# EasyEDA Pro project PCBPhaseidk.eprj

# Schematic PCBPhase
Create Date: 2024-09-20; Page Name: P1; Project Name: PCBPhase; Schematic Name: PCBPhase; Update Date: 2024-09-19; Company: EasyEDA.com; Drawn: EasyEDA; Page Size: A4; Part Number: JLCPCB-002; Reviewed: EasyEDA; Version: V0.1
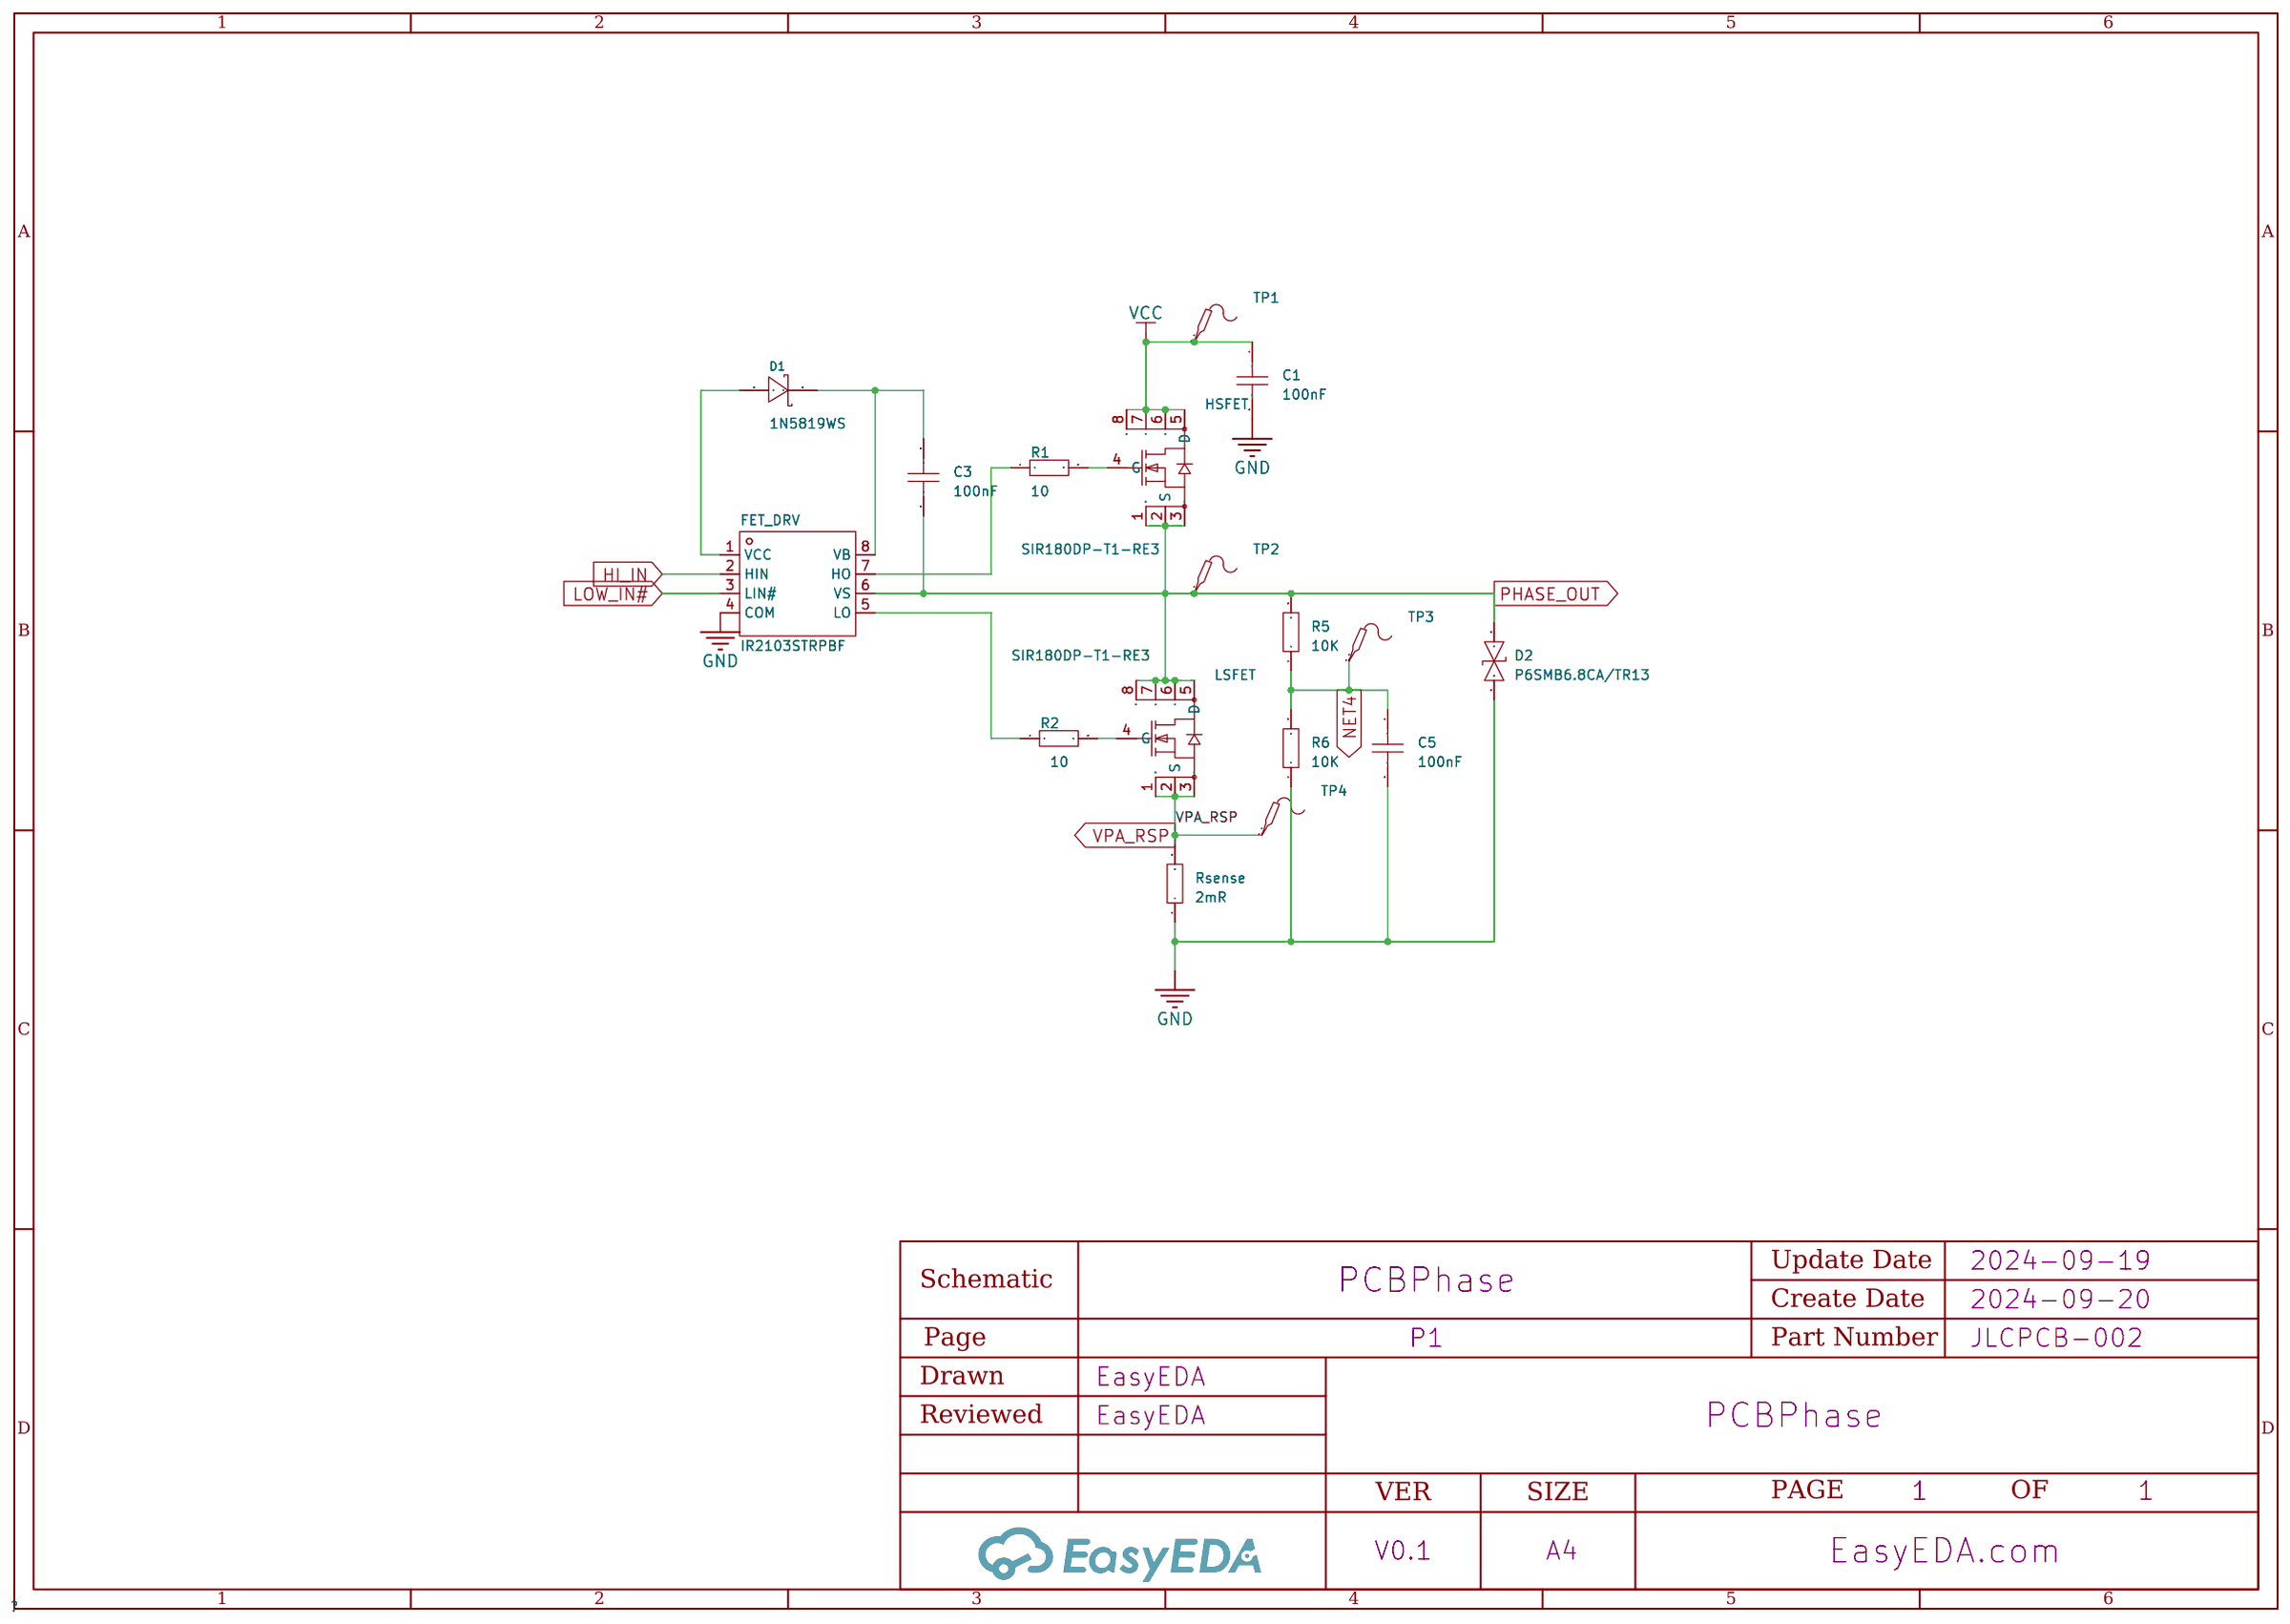
[diagram p0: schematic sheet]

## Parts
C1  100nF  [C0603]
C3  100nF  [C0603]
C5  100nF  [C0603]
D1  1N5819WS  [SOD-323_L1.8-W1.3-LS2.5-RD]
D2  P6SMB6.8CA/TR13  [SMB_L4.6-W3.6-LS5.3-BI]
FET_DRV  IR2103STRPBF  [SOIC-8_L4.9-W3.9-P1.27-LS6.0-BL]
HSFET  SIR180DP-T1-RE3  [POWERPAK-SO-8_L5.9-W4.9-P1.27-LS6.2-BL]
LSFET  SIR180DP-T1-RE3  [POWERPAK-SO-8_L5.9-W4.9-P1.27-LS6.2-BL]
R1  10  [R0603]
R2  10  [R0603]
R5  10K  [R0603]
R6  10K  [R0603]
Rsense  2mR  [R0603]
TP1  -  [Test-Point-0.5mm]
TP2  -  [Test-Point-0.5mm]
TP3  -  [Test-Point-0.5mm]
TP4  -  [Test-Point-0.5mm]

## Library data of the parts
C1 C3 C5 = CAP_0603: Supplier Footprint: 0603
D1 = 1N5819WS_C191023: Forward Voltage (Vf@If):600mV@1A Reverse Voltage (Vr):40V Average Rectified Current (Io):1A; LCSC Part Name: 电压:40V 电流:1A; Supplier Part: C191023; Manufacturer: Hottech(合科泰); Supplier Footprint: SOD-323; JLCPCB Part Class: Basic Part; Datasheet: https://atta.szlcsc.com/upload/public/pdf/source/20220428/3CB86FD8D28D653594B4E35F9D5AEFD9.pdf; Supplier: LCSC; Forward Voltage (Vf@If): 600mV@1A; Reverse Voltage (Vr): 40V; Average Rectified Current (Io): 1A
D2 = P6SMB6.8CA/TR13: Reverse Stand-Off Voltage (Vrwm):5.8V Maximum Clamping Voltage:10.5V Peak Pulse Current (Ipp)@10/1000us:58.1A Peak Pulse Power Dissipation (Ppp)@10/1000us:600W Breakdown Voltage:6.45V Type:TVS; Supplier Part: C78395; Manufacturer: Brightking(君耀电子); Supplier Footprint: SMB(DO-214AA); JLCPCB Part Class: Basic Part; Datasheet: https://atta.szlcsc.com/upload/public/pdf/source/20160709/1468031879762.pdf; Supplier: LCSC; Reverse Stand-Off Voltage (Vrwm): 5.8V; Maximum Clamping Voltage: 10.5V; Peak Pulse Current (Ipp)@10/1000us: 58.1A; Peak Pulse Power Dissipation (Ppp)@10/1000us: 600W; Breakdown Voltage: 6.45V; Type: TVS
FET_DRV = IR2103STRPBF: Driven Configuration:Half Bridge Load Type:MOSFET；IGBT Number of Drivers:2 Peak Output Current(sink):360mA Peak Output Current(source):210mA Supply Voltage:10V~20V Supply Voltage:10V~20V Rise Time:100ns Fall Time:50ns Operating Temperature:-40℃~+150℃@(Tj); Supplier Part: C2957; Manufacturer: Infineon(英飞凌); Supplier Footprint: SOIC-8; JLCPCB Part Class: Extended Part; Datasheet: https://atta.szlcsc.com/upload/public/pdf/source/20140228/1457706997637.pdf; Supplier: LCSC; Driven Configuration: Half Bridge; Load Type: MOSFET；IGBT; Number of Drivers: 2; Peak Output Current(sink): 360mA; Peak Output Current(source): 210mA; Supply Voltage: 10V~20V; Rise Time: 100ns; Fall Time: 50ns; Operating Temperature: -40℃~+150℃@(Tj)
HSFET LSFET = SIR180DP-T1-RE3: Type:1个NChannel Drain Source Voltage (Vdss):60V Continuous Drain Current (Id):；32.4A Power Dissipation (Pd):； Drain Source On Resistance (RDS(on)@Vgs,Id):2.05mΩ@10A,10V Gate Threshold Voltage (Vgs(th)@Id):3.6V@250uA Total Gate Charge (Qg@Vgs):87nC@10V Inp; LCSC Part Name: 1个N沟道 耐压:60V 电流:60A 电流:32.4A; Supplier Part: C5334421; Manufacturer: VISHAY(威世); Supplier Footprint: SO-8; JLCPCB Part Class: Extended Part; Datasheet: https://atta.szlcsc.com/upload/public/pdf/source/20221230/5EAF42ED79532020A551540FC13481A3.pdf; Supplier: LCSC; Type: 1个NChannel; Drain Source Voltage (Vdss): 60V; Continuous Drain Current (Id): ；32.4A; Power Dissipation (Pd): ；; Drain Source On Resistance (RDS(on)@Vgs,Id): 2.05mΩ@10A,10V; Gate Threshold Voltage (Vgs(th)@Id): 3.6V@250uA; Total Gate Charge (Qg@Vgs): 87nC@10V; Input Capacitance (Ciss@Vds): 4.03nF@30V; Operating Temperature: -55℃~+150℃@(Tj)
R1 R2 R5 R6 Rsense = Res_0603: Supplier Footprint: 0603
TP1-TP4 = Test-Point: Test Point 测试点

## Nets
GND: C1.2 C5.2 D2.1 FET_DRV.4(COM) R6.1 Rsense.1
VCC: C1.1 HSFET.5(D) HSFET.6(D) HSFET.7(D) HSFET.8(D) TP1.1
HI_IN: FET_DRV.2(HIN)
LOW_IN#: FET_DRV.3(LIN#)
NET4: C5.1 R5.1 R6.2 TP3.1
PHASE_OUT: C3.2 D2.2 FET_DRV.6(VS) HSFET.1(S) HSFET.2(S) HSFET.3(S) LSFET.5(D) LSFET.6(D) LSFET.7(D) LSFET.8(D) R5.2 TP2.1
VPA_RSP: LSFET.1(S) LSFET.2(S) LSFET.3(S) Rsense.2 TP4.1
$1N508: FET_DRV.7(HO) R1.1
$1N509: HSFET.4(G) R1.2
$1N510: FET_DRV.5(LO) R2.1
$1N511: LSFET.4(G) R2.2
$1N519: D1.2(A) FET_DRV.1(VCC)
$1N521: C3.1 D1.1(K) FET_DRV.8(VB)

# Schematic Schematic1
Create Date: 2024-09-20; Page Name: P1; Project Name: PCBPhase; Schematic Name: Schematic1; Update Date: 2024-09-20; Company: EasyEDA.com; Drawn: EasyEDA; Page Size: A4; Part Number: JLCPCB-002; Reviewed: EasyEDA; Version: V0.1
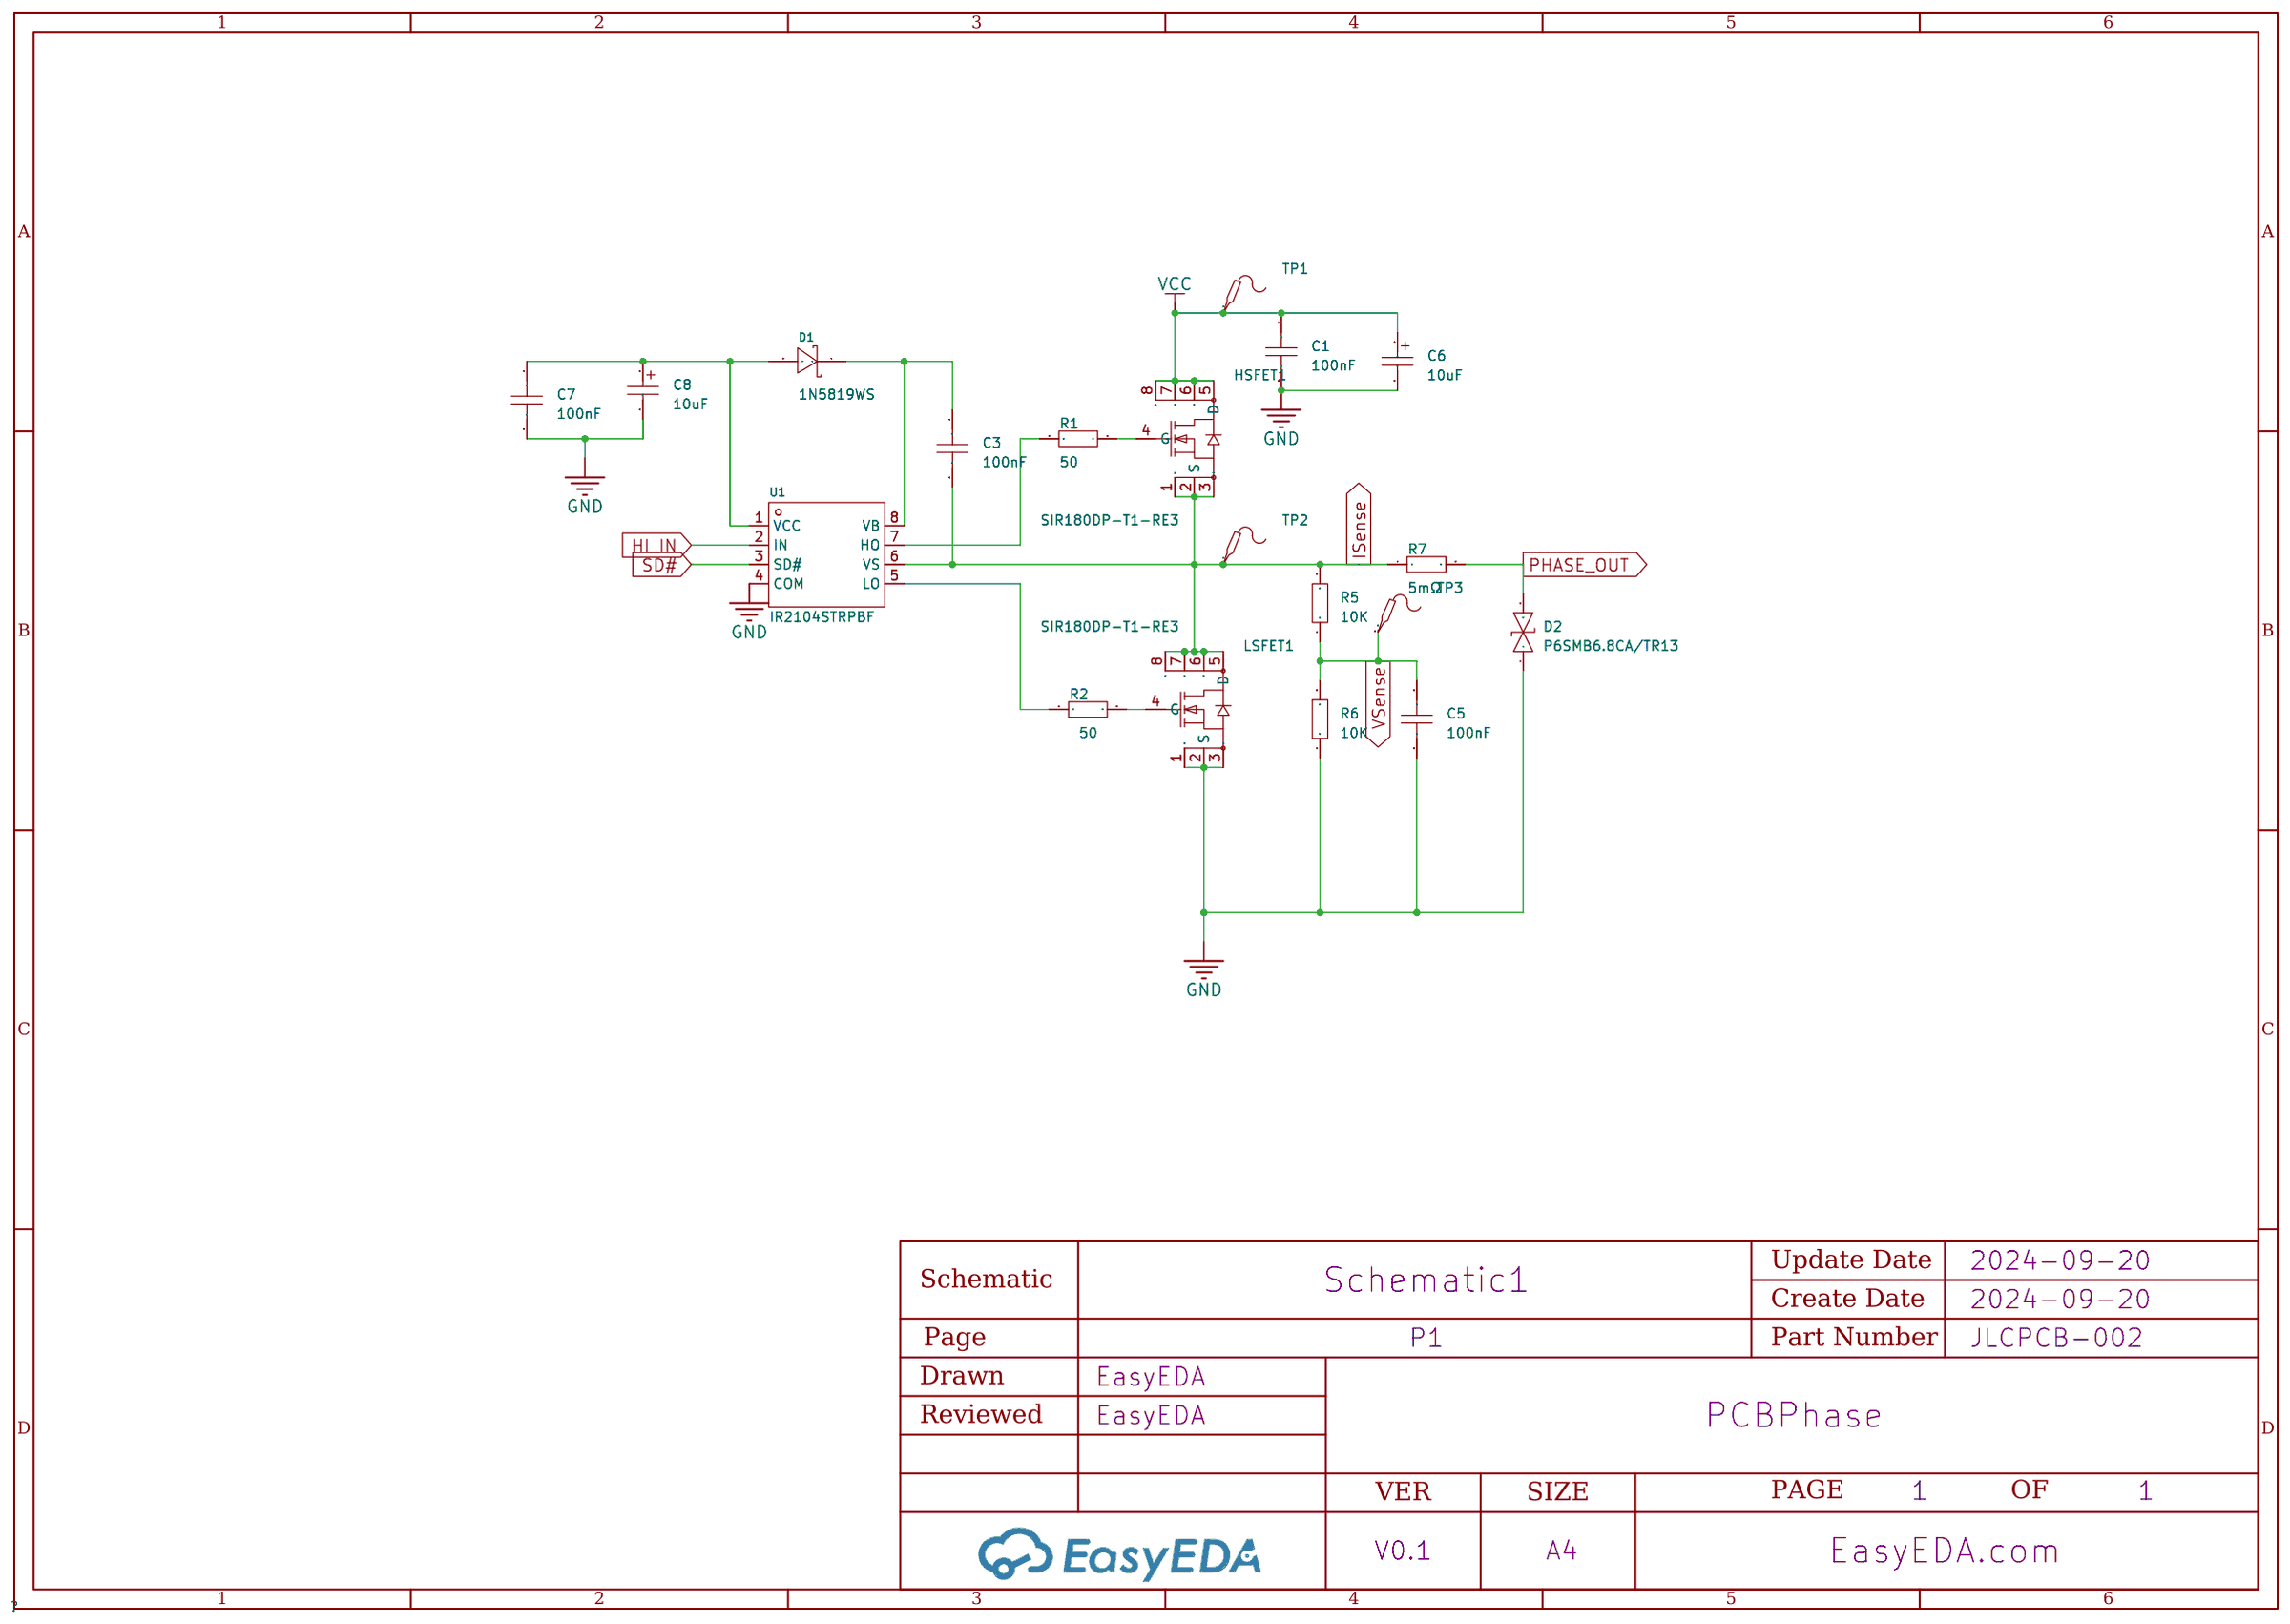
[diagram p1: schematic sheet]

## Parts
C1  100nF  [C0603]
C3  100nF  [C0603]
C5  100nF  [C0603]
C6  10uF  [CAP-SMD_BD3.0-L3.3-W3.3-RD]
C7  100nF  [C0603]
C8  10uF  [CAP-SMD_BD3.0-L3.3-W3.3-RD]
D1  1N5819WS  [SOD-323_L1.8-W1.3-LS2.5-RD]
D2  P6SMB6.8CA/TR13  [SMB_L4.6-W3.6-LS5.3-BI]
HSFET1  SIR180DP-T1-RE3  [POWERPAK-SO-8_L5.9-W4.9-P1.27-LS6.2-BL]
LSFET1  SIR180DP-T1-RE3  [POWERPAK-SO-8_L5.9-W4.9-P1.27-LS6.2-BL]
R1  50  [R0603]
R2  50  [R0603]
R5  10K  [R0603]
R6  10K  [R0603]
R7  5mΩ  [R2512]
TP1  -  [Test-Point-0.5mm]
TP2  -  [Test-Point-0.5mm]
TP3  -  [Test-Point-0.5mm]
U1  IR2104STRPBF  [SOIC-8_L4.9-W3.9-P1.27-LS6.0-BL]

## Library data of the parts
C1 C3 C5 C7 = CAP_0603: Supplier Footprint: 0603
C6 C8 = C_Ele_SMD_3x5.4mm: Supplier Footprint: SMD,3x5.4mm
D1 = 1N5819WS_C191023: Forward Voltage (Vf@If):600mV@1A Reverse Voltage (Vr):40V Average Rectified Current (Io):1A; LCSC Part Name: 电压:40V 电流:1A; Supplier Part: C191023; Manufacturer: Hottech(合科泰); Supplier Footprint: SOD-323; JLCPCB Part Class: Basic Part; Datasheet: https://atta.szlcsc.com/upload/public/pdf/source/20220428/3CB86FD8D28D653594B4E35F9D5AEFD9.pdf; Supplier: LCSC; Forward Voltage (Vf@If): 600mV@1A; Reverse Voltage (Vr): 40V; Average Rectified Current (Io): 1A
D2 = P6SMB6.8CA/TR13: Reverse Stand-Off Voltage (Vrwm):5.8V Maximum Clamping Voltage:10.5V Peak Pulse Current (Ipp)@10/1000us:58.1A Peak Pulse Power Dissipation (Ppp)@10/1000us:600W Breakdown Voltage:6.45V Type:TVS; Supplier Part: C78395; Manufacturer: Brightking(君耀电子); Supplier Footprint: SMB(DO-214AA); JLCPCB Part Class: Basic Part; Datasheet: https://atta.szlcsc.com/upload/public/pdf/source/20160709/1468031879762.pdf; Supplier: LCSC; Reverse Stand-Off Voltage (Vrwm): 5.8V; Maximum Clamping Voltage: 10.5V; Peak Pulse Current (Ipp)@10/1000us: 58.1A; Peak Pulse Power Dissipation (Ppp)@10/1000us: 600W; Breakdown Voltage: 6.45V; Type: TVS
HSFET1 LSFET1 = SIR180DP-T1-RE3: Type:1个NChannel Drain Source Voltage (Vdss):60V Continuous Drain Current (Id):；32.4A Power Dissipation (Pd):； Drain Source On Resistance (RDS(on)@Vgs,Id):2.05mΩ@10A,10V Gate Threshold Voltage (Vgs(th)@Id):3.6V@250uA Total Gate Charge (Qg@Vgs):87nC@10V Inp; LCSC Part Name: 1个N沟道 耐压:60V 电流:60A 电流:32.4A; Supplier Part: C5334421; Manufacturer: VISHAY(威世); Supplier Footprint: SO-8; JLCPCB Part Class: Extended Part; Datasheet: https://atta.szlcsc.com/upload/public/pdf/source/20221230/5EAF42ED79532020A551540FC13481A3.pdf; Supplier: LCSC; Type: 1个NChannel; Drain Source Voltage (Vdss): 60V; Continuous Drain Current (Id): ；32.4A; Power Dissipation (Pd): ；; Drain Source On Resistance (RDS(on)@Vgs,Id): 2.05mΩ@10A,10V; Gate Threshold Voltage (Vgs(th)@Id): 3.6V@250uA; Total Gate Charge (Qg@Vgs): 87nC@10V; Input Capacitance (Ciss@Vds): 4.03nF@30V; Operating Temperature: -55℃~+150℃@(Tj)
R1 R2 R5 R6 = Res_0603: Supplier Footprint: 0603
R7 = PA2512FKF7W0R005E: Type:Current Sensing Resistors Resistance: Tolerance:±1% Tolerance:±1% Power(Watts): Temperature Coefficient:±100ppm/℃ Temperature Coefficient:±100ppm/℃; LCSC Part Name: 5mΩ ±1% 2W; Supplier Part: C309526; Manufacturer: YAGEO(国巨); Supplier Footprint: 2512; JLCPCB Part Class: Extended Part; Datasheet: https://atta.szlcsc.com/upload/public/pdf/source/20190227/C375693_219964CC8B3EBD36DBDF701587FA5938.pdf; Supplier: LCSC; Type: Current Sensing Resistors; Tolerance: ±1%; Temperature Coefficient: ±100ppm/℃
TP1-TP3 = Test-Point: Test Point 测试点
U1 = IR2104STRPBF: Driven Configuration:Half Bridge Load Type:MOSFET；IGBT Number of Drivers:2 Peak Output Current(sink):360mA Peak Output Current(source):210mA Supply Voltage:10V~20V Supply Voltage:10V~20V Rise Time:100ns Fall Time:50ns Operating Temperature:-40℃~+150℃@(Tj); Supplier Part: C2960; Manufacturer: Infineon(英飞凌); Supplier Footprint: SOIC-8; JLCPCB Part Class: Extended Part; Datasheet: https://atta.szlcsc.com/upload/public/pdf/source/20140906/1457707236579.pdf; Supplier: LCSC; Driven Configuration: Half Bridge; Load Type: MOSFET；IGBT; Number of Drivers: 2; Peak Output Current(sink): 360mA; Peak Output Current(source): 210mA; Supply Voltage: 10V~20V; Rise Time: 100ns; Fall Time: 50ns; Operating Temperature: -40℃~+150℃@(Tj)

## Nets
GND: C1.2 C5.2 C6.2 C7.2 C8.2 D2.1 LSFET1.1(S) LSFET1.2(S) LSFET1.3(S) R6.1 U1.4(COM)
VCC: C1.1 C6.1 HSFET1.5(D) HSFET1.6(D) HSFET1.7(D) HSFET1.8(D) TP1.1
HI_IN: U1.2(IN)
ISense: C3.2 HSFET1.1(S) HSFET1.2(S) HSFET1.3(S) LSFET1.5(D) LSFET1.6(D) LSFET1.7(D) LSFET1.8(D) R5.2 R7.1 TP2.1 U1.6(VS)
PHASE_OUT: D2.2 R7.2
SD#: U1.3(SD#)
VSense: C5.1 R5.1 R6.2 TP3.1
$1N697: R1.1 U1.7(HO)
$1N698: HSFET1.4(G) R1.2
$1N699: R2.1 U1.5(LO)
$1N700: LSFET1.4(G) R2.2
$1N719: C3.1 D1.1(K) U1.8(VB)
$1N721: C7.1 C8.1 D1.2(A) U1.1(VCC)

# Schematic Schematic2
Create Date: 2024-09-20; Page Name: P1; Project Name: PCBPhase; Schematic Name: Schematic2; Update Date: 2024-09-20; Company: EasyEDA.com; Drawn: EasyEDA; Page Size: A4; Part Number: JLCPCB-002; Reviewed: EasyEDA; Version: V0.1
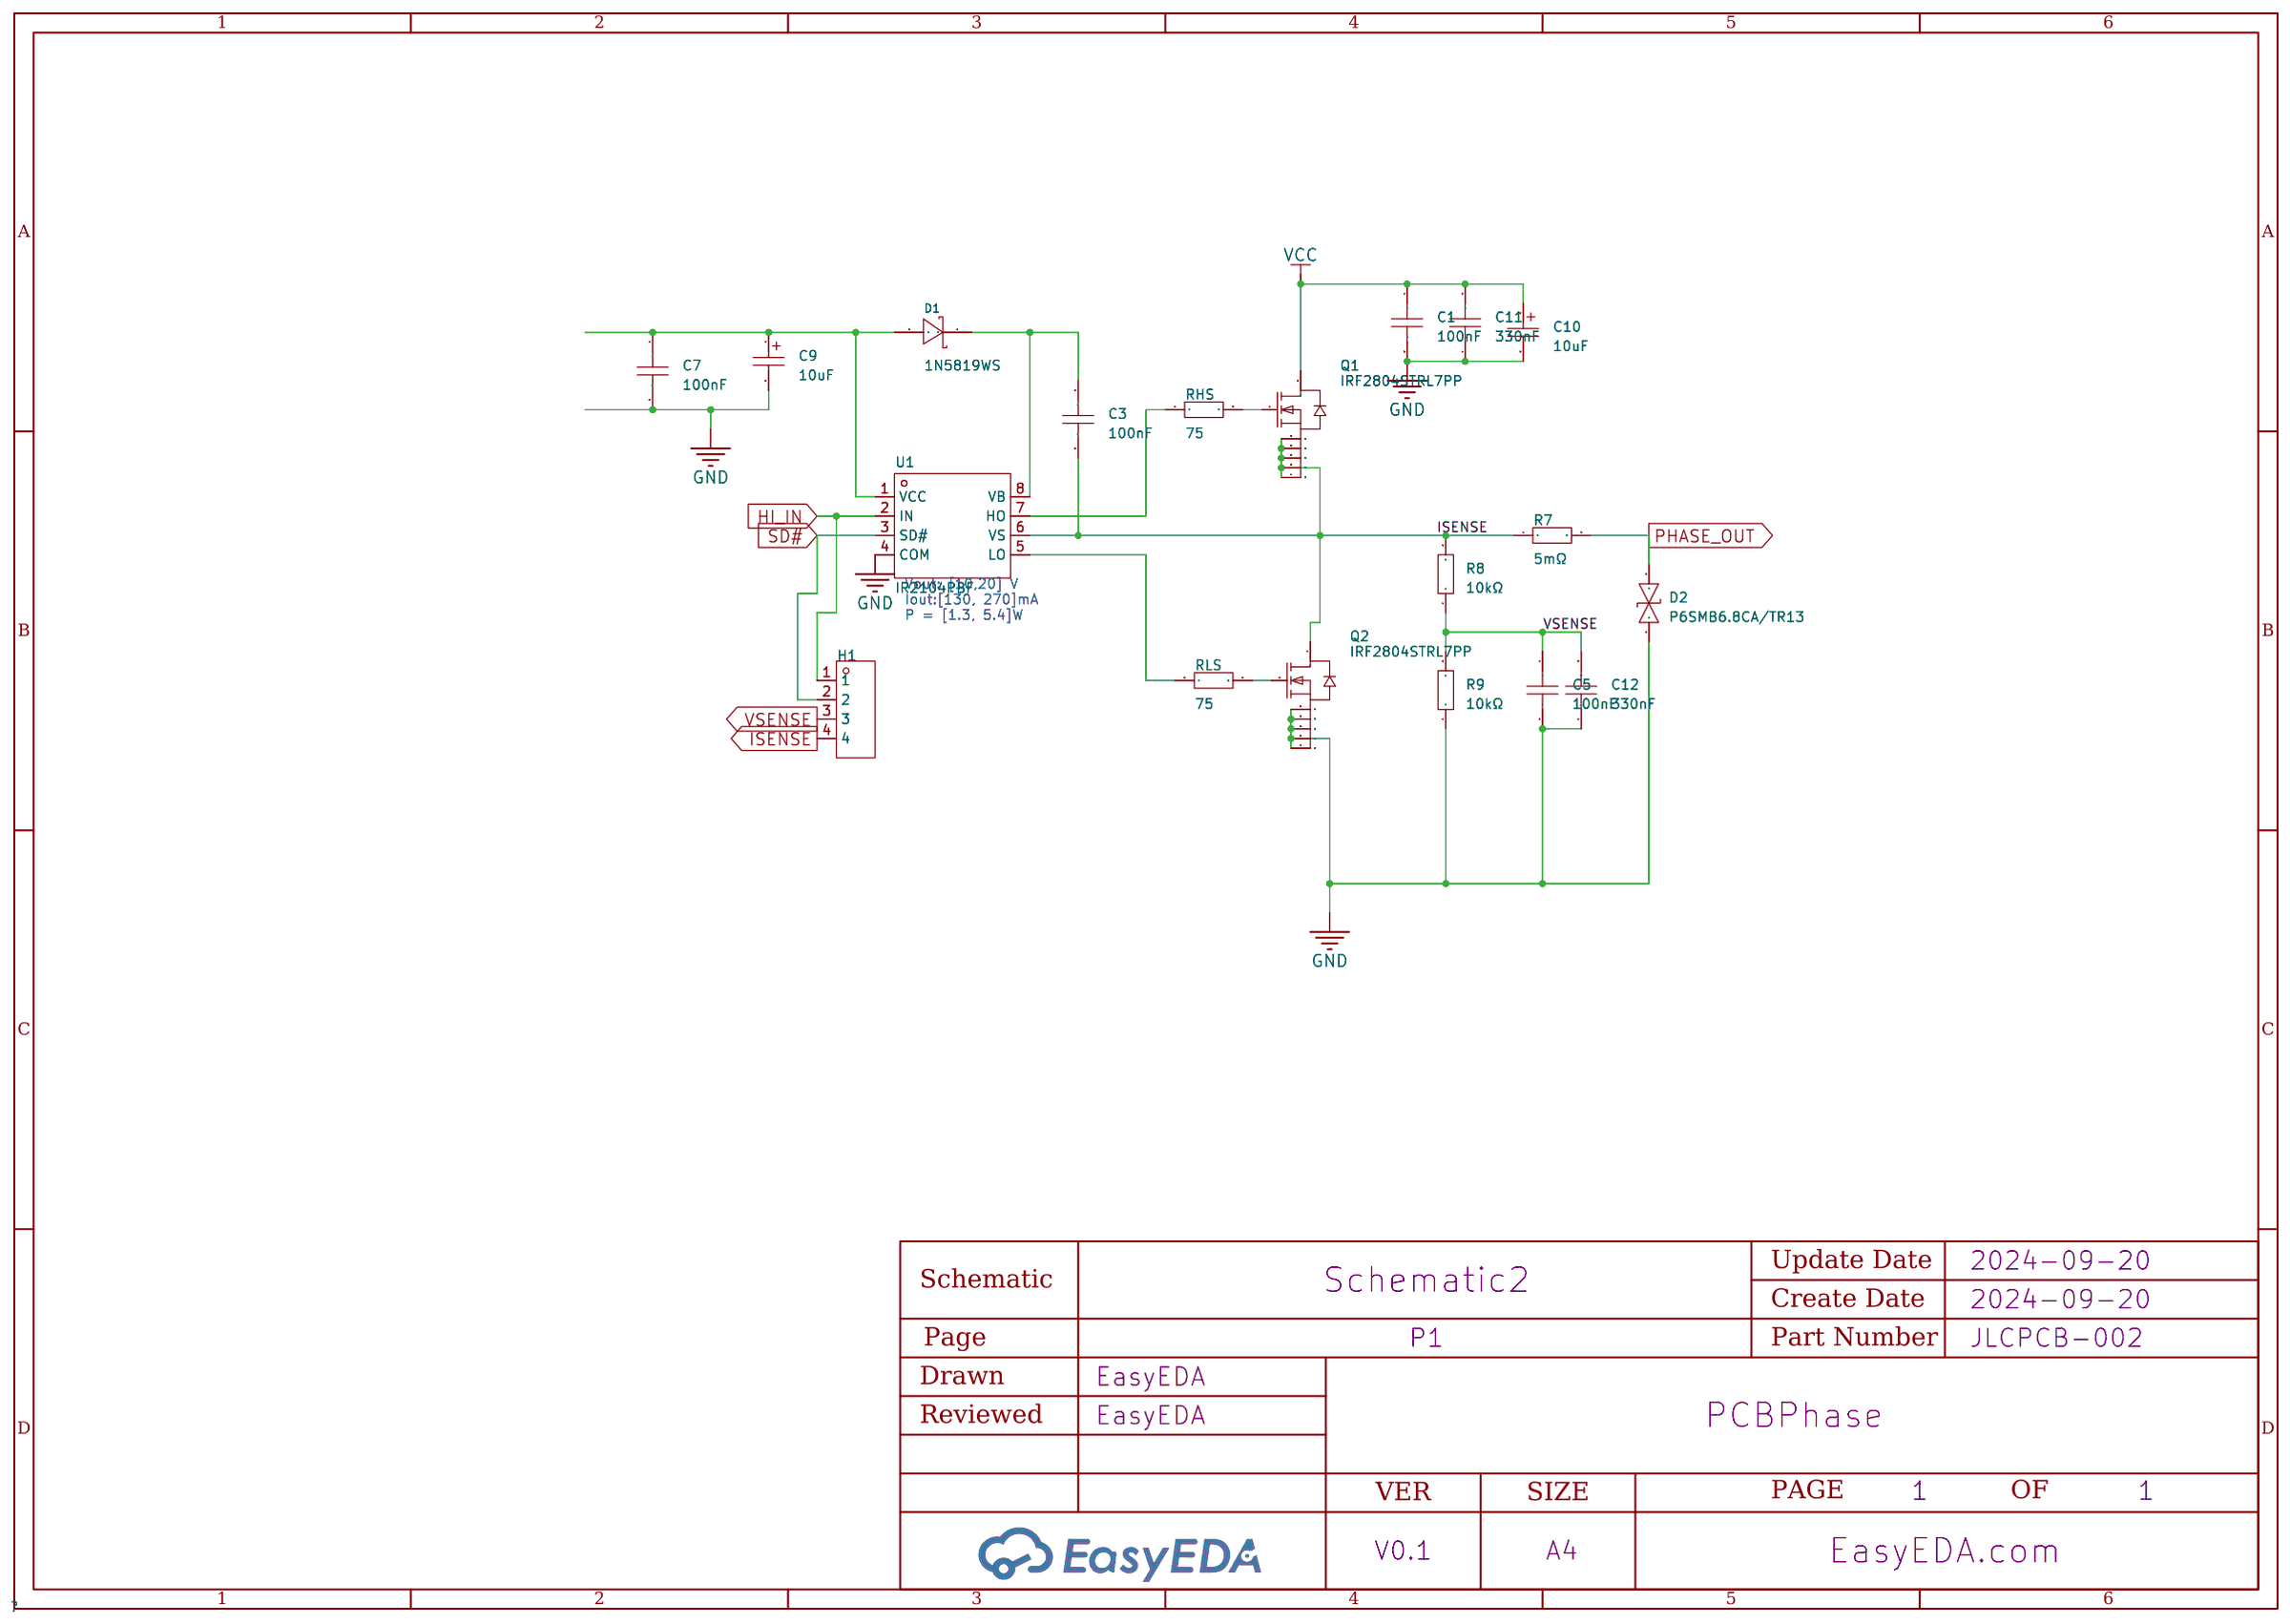
[diagram p2: schematic sheet]

## Parts
C1  100nF  [C0603]
C3  100nF  [C0603]
C5  100nF  [C0603]
C7  100nF  [C0603]
C9  10uF  [CAP-SMD_BD5.0-L5.3-W5.3-LS6.3-FD]
C10  10uF  [CAP-SMD_BD5.0-L5.3-W5.3-LS6.3-FD]
C11  330nF  [CAP-TH_L7.2-W2.5-P5.00-D0.6]
C12  330nF  [CAP-TH_L7.2-W2.5-P5.00-D0.6]
D1  1N5819WS  [SOD-323_L1.8-W1.3-LS2.5-RD]
D2  P6SMB6.8CA/TR13  [SMB_L4.6-W3.6-LS5.3-BI]
H1  -  [HDR-TH_4P-P2.54-V-M]
Q1  IRF2804STRL7PP  [D2PAK-7_L10.6-W9.6-P1.27-LS15.9-BR]
Q2  IRF2804STRL7PP  [D2PAK-7_L10.6-W9.6-P1.27-LS15.9-BR]
R7  5mΩ  [R2512]
R8  10kΩ  [RES-TH_BD3.3-L9.0-P13.00-D0.6]
R9  10kΩ  [RES-TH_BD3.3-L9.0-P13.00-D0.6]
RHS  75  [R1210]
RLS  75  [R1210]
U1  IR2104PBF  [DIP-8_L9.9-W6.6-P2.54-LS7.62-BL]

## Library data of the parts
C1 C3 C5 C7 = CAP_0603: Supplier Footprint: 0603
C9 C10 = C_Ele_SMD_5x5.4mm: Supplier Footprint: SMD,5x5.4mm
C11 C12 = SMEC334J100M2: Capacitance: Tolerance:±5% Tolerance:±5% Voltage Rated:; LCSC Part Name: 330nF ±5% 100V; Supplier Part: C401104; Manufacturer: CHAMPION(全鹏); Supplier Footprint: 插件,P=5mm; JLCPCB Part Class: Extended Part; Datasheet: https://atta.szlcsc.com/upload/public/pdf/source/20190730/C401104_3330673C3D333BC9993FC47731C2A492.pdf; Supplier: LCSC; Tolerance: ±5%
D1 = 1N5819WS_C191023: Forward Voltage (Vf@If):600mV@1A Reverse Voltage (Vr):40V Average Rectified Current (Io):1A; LCSC Part Name: 电压:40V 电流:1A; Supplier Part: C191023; Manufacturer: Hottech(合科泰); Supplier Footprint: SOD-323; JLCPCB Part Class: Basic Part; Datasheet: https://atta.szlcsc.com/upload/public/pdf/source/20220428/3CB86FD8D28D653594B4E35F9D5AEFD9.pdf; Supplier: LCSC; Forward Voltage (Vf@If): 600mV@1A; Reverse Voltage (Vr): 40V; Average Rectified Current (Io): 1A
D2 = P6SMB6.8CA/TR13: Reverse Stand-Off Voltage (Vrwm):5.8V Maximum Clamping Voltage:10.5V Peak Pulse Current (Ipp)@10/1000us:58.1A Peak Pulse Power Dissipation (Ppp)@10/1000us:600W Breakdown Voltage:6.45V Type:TVS; Supplier Part: C78395; Manufacturer: Brightking(君耀电子); Supplier Footprint: SMB(DO-214AA); JLCPCB Part Class: Basic Part; Datasheet: https://atta.szlcsc.com/upload/public/pdf/source/20160709/1468031879762.pdf; Supplier: LCSC; Reverse Stand-Off Voltage (Vrwm): 5.8V; Maximum Clamping Voltage: 10.5V; Peak Pulse Current (Ipp)@10/1000us: 58.1A; Peak Pulse Power Dissipation (Ppp)@10/1000us: 600W; Breakdown Voltage: 6.45V; Type: TVS
H1 = HDR-M_2.54_1x4P: Supplier Footprint: Through
Q1 Q2 = IRF2804STRL7PP: Supplier Part: C459950; Manufacturer: Infineon(英飞凌); Supplier Footprint: TO-252-3; JLCPCB Part Class: Extended Part; Datasheet: https://atta.szlcsc.com/upload/public/pdf/source/20211220/39CD65D483719D465F1A88FFAD2C5DF5.pdf; Supplier: LCSC
R7 = PA2512FKF7W0R005E: Type:Current Sensing Resistors Resistance: Tolerance:±1% Tolerance:±1% Power(Watts): Temperature Coefficient:±100ppm/℃ Temperature Coefficient:±100ppm/℃; LCSC Part Name: 5mΩ ±1% 2W; Supplier Part: C309526; Manufacturer: YAGEO(国巨); Supplier Footprint: 2512; JLCPCB Part Class: Extended Part; Datasheet: https://atta.szlcsc.com/upload/public/pdf/source/20190227/C375693_219964CC8B3EBD36DBDF701587FA5938.pdf; Supplier: LCSC; Type: Current Sensing Resistors; Tolerance: ±1%; Temperature Coefficient: ±100ppm/℃
R8 R9 = Res_AXIAL-1/2W: Supplier Footprint: Through
RHS RLS = Res_1210: Supplier Footprint: 1210
U1 = IR2104PBF: Driven Configuration:Half Bridge Load Type:MOSFET；IGBT Number of Drivers:2 Peak Output Current(sink):360mA Peak Output Current(source):210mA Supply Voltage:10V~20V Supply Voltage:10V~20V Rise Time:100ns Fall Time:50ns Operating Temperature:-40℃~+150℃@(Tj); LCSC Part Name: IR2104PBF 停产; Supplier Part: C2959; Manufacturer: Infineon(英飞凌); Supplier Footprint: PDIP-8; JLCPCB Part Class: Extended Part; Datasheet: https://atta.szlcsc.com/upload/public/pdf/source/20140906/1457707236579.pdf; Supplier: LCSC; Driven Configuration: Half Bridge; Load Type: MOSFET；IGBT; Number of Drivers: 2; Peak Output Current(sink): 360mA; Peak Output Current(source): 210mA; Supply Voltage: 10V~20V; Rise Time: 100ns; Fall Time: 50ns; Operating Temperature: -40℃~+150℃@(Tj)

## Nets
GND: C1.2 C5.2 C7.2 C9.2 C10.2 C11.1 C12.1 D2.1 Q2.2(S) Q2.3(S) Q2.5(S) Q2.6(S) Q2.7(S) R9.1 U1.4(COM)
VCC: C1.1 C10.1 C11.2 Q1.4(D)
HI_IN: H1.1 U1.2(IN)
ISENSE: C3.2 H1.4 Q1.2(S) Q1.3(S) Q1.5(S) Q1.6(S) Q1.7(S) Q2.4(D) R7.1 R8.2 U1.6(VS)
PHASE_OUT: D2.2 R7.2
SD#: H1.2 U1.3(SD#)
VSENSE: C5.1 C12.2 H1.3 R8.1 R9.2
$1N697: RHS.1 U1.7(HO)
$1N698: Q1.1(G) RHS.2
$1N699: RLS.1 U1.5(LO)
$1N700: Q2.1(G) RLS.2
$1N719: C3.1 D1.1(K) U1.8(VB)
$1N2292: C7.1 C9.1 D1.2(A) U1.1(VCC)

## Notes on the sheet
- Vout: [10,20] V
  Iout:[130, 270]mA
  P = [1.3, 5.4]W

# Board PCB4
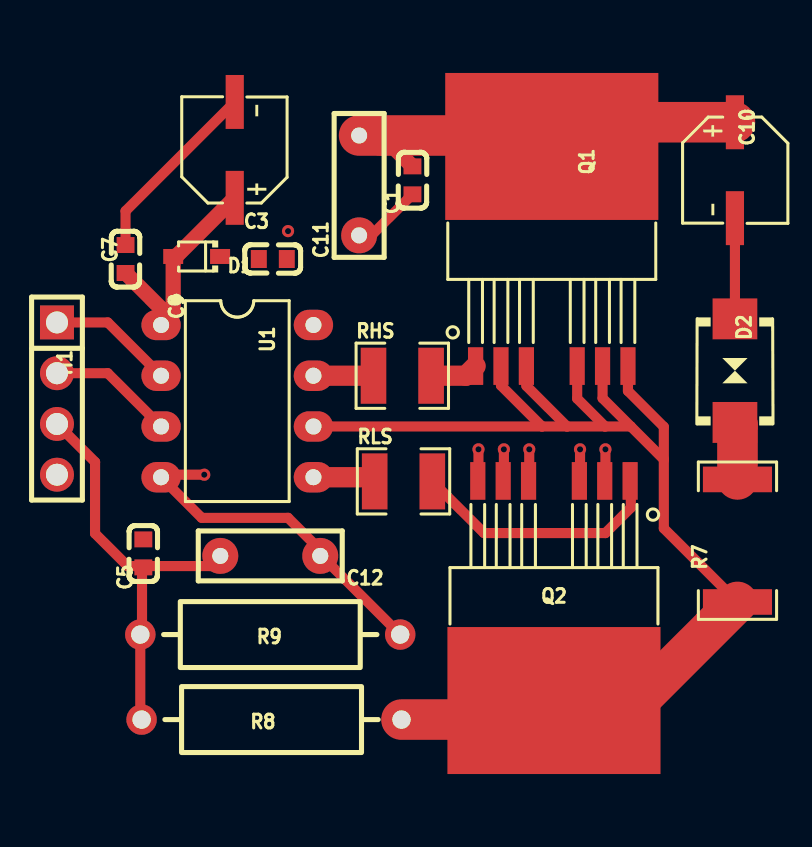
[diagram p3: board, top side]
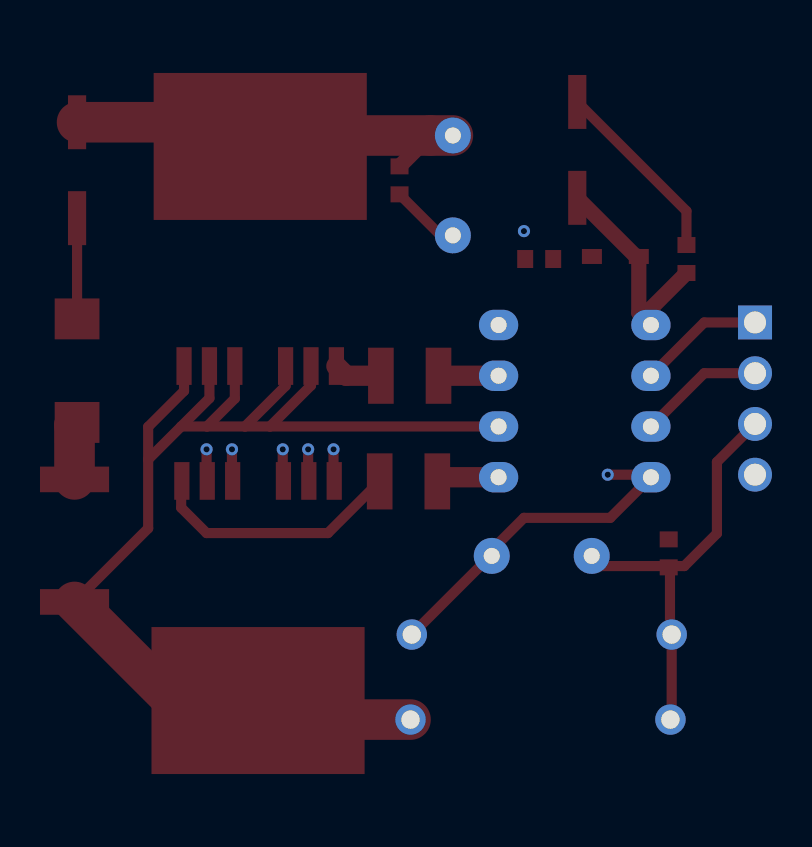
[diagram p4: board, bottom side, seen from below]

No outline. copper layers: Top Layer, Bottom Layer. Coordinates in mm from the lowest, leftmost part position.
Stack: Top Layer 0.035mm / Dielectric1 1.51mm FR4 er 4.5 / Bottom Layer 0.035mm

## Design rules (mm)
template: JLCPCB Capability(Two Layers Board)
spacing copperThickness1oz (default): track to track 0.102, other pairs 0.152 to 0.3
spacing copperThickness2oz: track to track 0.203, other pairs 0.152 to 0.3
track width copperThickness1oz (default): min 0.127, default 0.254, max 2.54
track width copperThickness2oz: min 0.203, default 0.254, max 2.54
differential pair differentialPair (default): width min 0.127, default 0.254, max 2.54; gap min 0.152, default 0.152
via viaSize (default): diameter min 0.5, default 0.61, max 10; hole min 0.3, default 0.305, max 6.3

## Placement (name value [footprint] x y rotation side)
C1  100nF  [C0603]  17.78 26.99 270 top
C3  100nF  [C0603]  10.79 23.05 0 top
C5  100nF  [C0603]  4.32 8.32 90 top
C7  100nF  [C0603]  3.43 23.05 90 top
C9  10uF  [CAP-SMD_BD5.0-L5.3-W5.3-LS6.3-FD]  8.89 28.51 90 top
C10  10uF  [CAP-SMD_BD5.0-L5.3-W5.3-LS6.3-FD]  33.91 27.5 270 top
C11  330nF  [CAP-TH_L7.2-W2.5-P5.00-D0.6]  15.11 26.73 90 top
C12  330nF  [CAP-TH_L7.2-W2.5-P5.00-D0.6]  10.67 8.19 180 top
D1  1N5819WS  [SOD-323_L1.8-W1.3-LS2.5-RD]  6.99 23.18 180 top
D2  P6SMB6.8CA/TR13  [SMB_L4.6-W3.6-LS5.3-BI]  33.91 17.46 270 top
H1  -  [HDR-TH_4P-P2.54-V-M]  0 16.07 270 top
Q1  IRF2804STRL7PP  [D2PAK-7_L10.6-W9.6-P1.27-LS15.9-BR]  24.75 23.19 270 top
Q2  IRF2804STRL7PP  [D2PAK-7_L10.6-W9.6-P1.27-LS15.9-BR]  24.86 6.45 90 top
R7  5mΩ  [R2512]  34.04 8.95 90 top
R8  10kΩ  [RES-TH_BD3.3-L9.0-P13.00-D0.6]  10.73 0 0 top
R9  10kΩ  [RES-TH_BD3.3-L9.0-P13.00-D0.6]  10.67 4.25 180 top
RHS  75  [R1210]  17.27 17.21 0 top
RLS  75  [R1210]  17.33 11.92 0 top
U1  IR2104PBF  [DIP-8_L9.9-W6.6-P2.54-LS7.62-BL]  9.02 15.94 270 top

## Footprints (pads in the part's own frame, mm; a bottom-side part is the same pattern mirrored in y, then rotated)
C0603
  rect 0.8x0.9 smd: 1(-0.7,0) 2(0.7,0)
CAP-SMD_BD5.0-L5.3-W5.3-LS6.3-FD
  rect 2.7x0.91 smd: 1(-2.4,0) 2(2.4,0)
CAP-TH_L7.2-W2.5-P5.00-D0.6
  round 1.8 hole 0.8: 1(-2.499,0) 2(2.499,0)
D2PAK-7_L10.6-W9.6-P1.27-LS15.9-BR
  rect 1.887x0.762 smd: 1(5.495,-3.81) 2(5.495,-2.54) 3(5.495,-1.27) 5(5.495,1.27) 6(5.495,2.54) 7(5.495,3.81)
  rect 7.356x10.66 smd: 4(-5.495,0)
DIP-8_L9.9-W6.6-P2.54-LS7.62-BL
  oval 1.524x1.97 hole 0.8: 1(-3.81,-3.81) 2(-1.27,-3.81) 3(1.27,-3.81) 4(3.81,-3.81) 5(3.81,3.81) 6(1.27,3.81) 7(-1.27,3.81) 8(-3.81,3.81)
HDR-TH_4P-P2.54-V-M
  rect 1.7x1.7 hole 1.1: 1(-3.81,0)
  round 1.7 hole 1.1: 2(-1.27,0) 3(1.27,0) 4(3.81,0)
R1210
  rect 1.282x2.808 smd: 1(-1.441,0) 2(1.441,0)
R2512
  rect 1.282x3.456 smd: 1(-3.067,0) 2(3.067,0)
RES-TH_BD3.3-L9.0-P13.00-D0.6
  round 1.524 hole 0.914: 1(-6.5,0) 2(6.5,0)
SMB_L4.6-W3.6-LS5.3-BI
  rect 2.047x2.241 smd: 1(-2.591,0) 2(2.591,0)
SOD-323_L1.8-W1.3-LS2.5-RD
  rect 1x0.75 smd: 1(-1.173,0) 2(1.173,0)

## Nets
As in the schematic.

## Via types
v1: diameter 0.61, hole 0.305, Top Layer to Bottom Layer, 7 vias

## Routing (per net, layer and track width the routed paths; a pad name or vN(x,y) marks a point on that pad's centre or on a via; arc(x,y) is an arc through that point)
GND: length 43.6
  Top Layer w0.508: R9.1 13.23,8.19 C12.1 13.17,8.49 11.56,10.1 7.24,10.1 U1.4 5.33,12.26 v1(7.37,12.26) ; v1(27.43,13.53) 27.43,11.98 Q2.2 ; C1.2 15.73,24.23 C11.1 ; D2.1 C10.2 ; v1(21.08,13.53) 21.08,11.98 Q2.7 ; Q2.6 22.35,11.98 v1(22.35,13.53) ; C9.2 3.43,25.45 C7.2 ; v1(26.16,13.53) 26.16,11.98 Q2.3 ; Q2.5 23.62,11.98 v1(23.62,13.53)
  vias: v1(11.56,24.45)
VCC: length 21.7
  Top Layer w0.762: C1.1 16.23,29.23
  Top Layer w2.032: C11.2 24.2,29.23 Q1.4 25.96,29.9 C10.1
HI_IN: length 6.3
  Top Layer w0.508: U1.2 2.54,19.88 H1.1
ISENSE: length 67
  Top Layer w0.508: 27.42,14.67 26.02,16.07 Q1.5 ; 27.42,14.67 28.7,14.67 ; 27.42,14.67 25.51,14.67 ; U1.6 24.26,14.67 ; 24.26,14.67 22.21,16.72 Q1.2 ; 24.26,14.67 25.51,14.67 ; 28.7,14.67 30.35,13.02 ; 28.7,14.67 27.29,16.08 Q1.6 ; 30.35,13.02 30.35,9.57 R7.1 34.04,6.4 ; 30.35,13.02 30.35,14.65 28.56,16.45 Q1.7 ; Q1.3 23.48,16.7 25.51,14.67
  Top Layer w2.032: R7.1 29.1,0.95 Q2.4 23.91,0 R8.2
PHASE_OUT: length 2.9
  Top Layer w2.032: R7.2 34.04,14.74 D2.2
SD#: length 6.3
  Top Layer w0.508: H1.2 2.54,17.34 U1.3
VSENSE: length 21.3
  Top Layer w0.508: C12.2 7.66,7.68 4.25,7.68 ; 4.25,7.68 4.25,4.34 R9.2 4.17,0.06 R8.1 ; 4.25,7.68 3.53,7.68 1.91,9.31 1.91,12.89 H1.3 ; 4.25,7.68 C5.1
$1N697: length 3
  Top Layer w1.016: U1.7 RHS.1
$1N698: length 2.4
  Top Layer w1.016: Q1.1 20.45,17.21 RHS.2
$1N699: length 3.1
  Top Layer w1.016: U1.5 15.68,12.13 RLS.1
$1N700: length 12.9
  Top Layer w0.508: Q2.1 28.7,11.91 28.7,10.6 27.43,9.33 21.36,9.33 RLS.2
$1N2292: length 11.3
  Top Layer w0.762: C7.1 5.21,20.57 U1.1 5.81,20.35 D1.2 5.96,23.18 C9.1

# Board PCB3
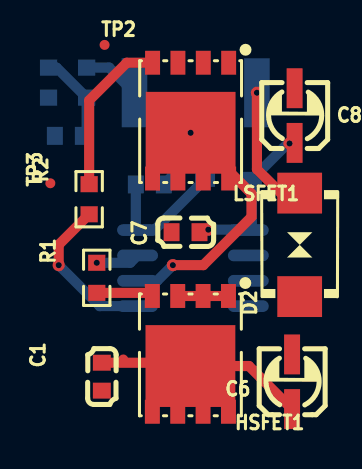
[diagram p5: board, top side]
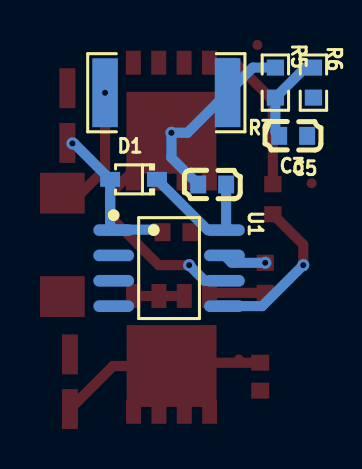
[diagram p6: board, bottom side, seen from below]

No outline. copper layers: Top Layer, Bottom Layer. Coordinates in mm from the lowest, leftmost part position.
Stack: Top Layer 0.035mm / Dielectric1 1.51mm FR4 er 4.5 / Bottom Layer 0.035mm

## Design rules (mm)
template: JLCPCB Capability(Two Layers Board)
spacing copperThickness1oz (default): track to track 0.102, other pairs 0.152 to 0.3
spacing copperThickness2oz: track to track 0.203, other pairs 0.152 to 0.3
track width copperThickness1oz (default): min 0.127, default 0.254, max 2.54
track width copperThickness2oz: min 0.203, default 0.254, max 2.54
differential pair differentialPair (default): width min 0.127, default 0.254, max 2.54; gap min 0.152, default 0.152
via viaSize (default): diameter min 0.5, default 0.61, max 10; hole min 0.3, default 0.305, max 6.3

## Placement (name value [footprint] x y rotation side)
C1  100nF  [C0603]  2.67 0.25 270 top
C3  100nF  [C0603]  5.07 9.88 0 bottom
C5  100nF  [C0603]  1.02 12.32 180 bottom
C6  10uF  [CAP-SMD_BD3.0-L3.3-W3.3-RD]  12.19 0 270 top
C7  100nF  [C0603]  6.86 7.49 180 top
C8  10uF  [CAP-SMD_BD3.0-L3.3-W3.3-RD]  12.32 13.33 270 top
D1  1N5819WS  [SOD-323_L1.8-W1.3-LS2.5-RD]  9.01 10.14 0 bottom
D2  P6SMB6.8CA/TR13  [SMB_L4.6-W3.6-LS5.3-BI]  12.57 6.86 90 top
HSFET1  SIR180DP-T1-RE3  [POWERPAK-SO-8_L5.9-W4.9-P1.27-LS6.2-BL]  7.1 1.4 180 top
LSFET1  SIR180DP-T1-RE3  [POWERPAK-SO-8_L5.9-W4.9-P1.27-LS6.2-BL]  7.11 13.08 180 top
R1  50  [R0603]  2.41 5.21 270 top
R2  50  [R0603]  2.03 9.14 90 top
R5  10K  [R0603]  1.91 14.99 90 bottom
R6  10K  [R0603]  0 14.99 90 bottom
R7  5mΩ  [R2512]  7.37 14.48 0 bottom
TP1  -  [Test-Point-0.5mm]  3.74 1.12 180 top
TP2  -  [Test-Point-0.5mm]  2.8 16.87 0 top
TP3  -  [Test-Point-0.5mm]  0.09 9.94 90 top
U1  IR2104STRPBF  [SOIC-8_L4.9-W3.9-P1.27-LS6.0-BL]  7.23 5.69 270 bottom

## Footprints (pads in the part's own frame, mm; a bottom-side part is the same pattern mirrored in y, then rotated)
C0603
  rect 0.8x0.9 smd: 1(-0.7,0) 2(0.7,0)
CAP-SMD_BD3.0-L3.3-W3.3-RD
  rect 2x0.8 smd: 1(1.37,0) 2(-1.37,0)
POWERPAK-SO-8_L5.9-W4.9-P1.27-LS6.2-BL
  rect 0.75x1.2 smd: 1(-1.905,-2.9) 2(-0.635,-2.9) 3(0.635,-2.9) 4(1.905,-2.9) 5(1.905,2.9) 6(0.635,2.9) 7(-0.635,2.9) 8(-1.905,2.9)
  rect 4.5x4.1 smd: 8(0,0.609)
R0603
  rect 0.806x0.864 smd: 1(-0.753,0) 2(0.753,0)
R2512
  rect 1.282x3.456 smd: 1(-3.067,0) 2(3.067,0)
SMB_L4.6-W3.6-LS5.3-BI
  rect 2.047x2.241 smd: 1(-2.591,0) 2(2.591,0)
SOD-323_L1.8-W1.3-LS2.5-RD
  rect 1x0.75 smd: 1(-1.173,0) 2(1.173,0)
SOIC-8_L4.9-W3.9-P1.27-LS6.0-BL
  oval 0.588x2.045 smd: 1(-1.905,-2.772) 2(-0.635,-2.772) 3(0.635,-2.772) 4(1.905,-2.772) 5(1.905,2.772) 6(0.635,2.772) 7(-0.635,2.772) 8(-1.905,2.772)
Test-Point-0.5mm
  round 0.5 smd: 1(0,0)

## Nets
As in the schematic, except:
ISENSE: C3.2 HSFET1.1 HSFET1.2 HSFET1.3 LSFET1.5 LSFET1.6 LSFET1.7 LSFET1.8 R5.2 R7.1 TP2.1 U1.6
VSENSE: C5.1 R5.1 R6.2 TP3.1

## Via types
v1: diameter 0.61, hole 0.305, Top Layer to Bottom Layer, 7 vias

## Routing (per net, layer and track width the routed paths; a pad name or vN(x,y) marks a point on that pad's centre or on a via; arc(x,y) is an arc through that point)
VCC: length 10.5
  Top Layer w0.508: C6.1 10.03,0.79 HSFET1.8 6.94,0.95 C1.1
ISENSE: length 24.8
  Top Layer w0.508: HSFET1.3 HSFET1.1 ; v1(7.11,12.47) 10.16,9.42 10.16,8.25 7.75,5.84 v1(6.22,5.84)
  Bottom Layer w0.508: C3.2 7.11,11.23 v1(7.11,12.47) 6.31,12.47 R7.1 3.04,15.74 R5.2 ; v1(6.22,5.84) 5.44,5.06 U1.6
PHASE_OUT: length 6.9
  Top Layer w0.508: v1(10.43,14.48) 10.43,10.65 12.1,8.98 D2.2
VSENSE: length 4.5
  Bottom Layer w0.508: R6.2 0.4,15.74 R5.1 1.91,12.51 C5.1
$1N697: length 2.2
  Bottom Layer w0.508: v1(2.41,5.96) 4.09,5.96 U1.7
$1N698: length 2.8
  Top Layer w0.508: HSFET1.4 5.04,4.45 R1.2
$1N699: length 8
  Top Layer w0.508: v1(0.51,5.84) 0.51,6.87 R2.1
  Bottom Layer w0.508: v1(0.51,5.84) 2.56,3.79 U1.5
$1N700: length 8.2
  Top Layer w0.508: LSFET1.4 3.92,15.98 2.03,14.1 R2.2
$1N719: length 6.8
  Bottom Layer w0.508: C3.1 4.37,7.69 U1.8 5.29,7.6 D1.1
$1N721: length 8
  Top Layer w0.508: C8.1 12.09,11.96 v1(12.06,11.94) ; C7.1 7.69,7.62 v1(8,7.62)
  Bottom Layer w0.508: v1(12.06,11.94) 11.98,11.94 D1.2 10.18,7.78 U1.1 9.98,7.62 v1(8,7.62)

# Board PCB2
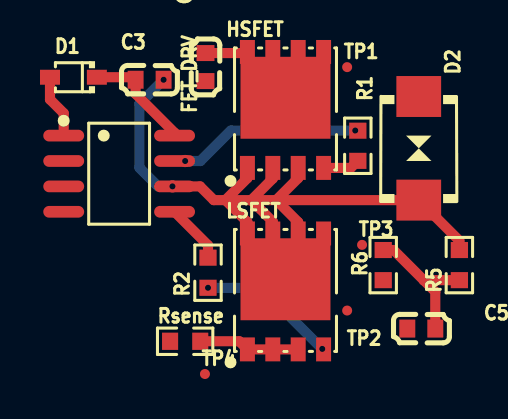
[diagram p7: board, top side]
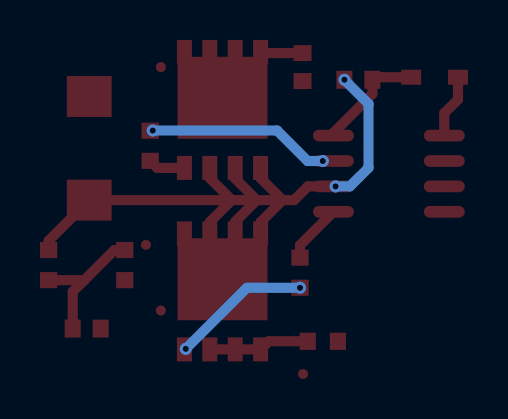
[diagram p8: board, bottom side, seen from below]

No outline. copper layers: Top Layer, Bottom Layer. Coordinates in mm from the lowest, leftmost part position.
Stack: Top Layer 0.035mm / Dielectric1 1.51mm FR4 er 4.5 / Bottom Layer 0.035mm

## Design rules (mm)
template: JLCPCB Capability(Two Layers Board)
spacing copperThickness1oz (default): track to track 0.102, other pairs 0.152 to 0.3
spacing copperThickness2oz: track to track 0.203, other pairs 0.152 to 0.3
track width copperThickness1oz (default): min 0.127, default 0.254, max 2.54
track width copperThickness2oz: min 0.203, default 0.254, max 2.54
differential pair differentialPair (default): width min 0.127, default 0.254, max 2.54; gap min 0.152, default 0.152
via viaSize (default): diameter min 0.5, default 0.61, max 10; hole min 0.3, default 0.305, max 6.3

## Placement (name value [footprint] x y rotation side)
C1  100nF  [C0603]  6.6 15.35 270 top
C3  100nF  [C0603]  3.81 14.72 0 top
C5  100nF  [C0603]  17.4 2.27 180 top
D1  1N5819WS  [SOD-323_L1.8-W1.3-LS2.5-RD]  0 14.85 180 top
D2  P6SMB6.8CA/TR13  [SMB_L4.6-W3.6-LS5.3-BI]  17.27 11.29 270 top
FET_DRV  IR2103STRPBF  [SOIC-8_L4.9-W3.9-P1.27-LS6.0-BL]  2.29 10.02 270 top
HSFET  SIR180DP-T1-RE3  [POWERPAK-SO-8_L5.9-W4.9-P1.27-LS6.2-BL]  10.61 13.21 0 top
LSFET  SIR180DP-T1-RE3  [powerpak-so-8_l5.9-w4.9-p1.27-ls6.2-bl]  10.61 4.13 0 top
R1  10  [R0603]  14.22 11.42 270 top
R2  10  [R0603]  6.73 5.07 270 top
R5  10K  [R0603]  19.3 5.45 90 top
R6  10K  [R0603]  15.49 5.45 90 top
Rsense  2mR  [R0603]  5.59 1.64 0 top
TP1  -  [Test-Point-0.5mm]  13.69 15.35 0 top
TP2  -  [Test-Point-0.5mm]  13.69 3.18 0 top
TP3  -  [Test-Point-0.5mm]  14.44 6.46 0 top
TP4  -  [Test-Point-0.5mm]  6.58 0 0 top

## Footprints (pads in the part's own frame, mm; a bottom-side part is the same pattern mirrored in y, then rotated)
C0603
  rect 0.8x0.9 smd: 1(-0.7,0) 2(0.7,0)
POWERPAK-SO-8_L5.9-W4.9-P1.27-LS6.2-BL
  rect 0.75x1.2 smd: 1(-1.905,-2.9) 2(-0.635,-2.9) 3(0.635,-2.9) 4(1.905,-2.9) 5(1.905,2.9) 6(0.635,2.9) 7(-0.635,2.9) 8(-1.905,2.9)
  rect 4.5x4.1 smd: 8(0,0.609)
powerpak-so-8_l5.9-w4.9-p1.27-ls6.2-bl
  rect 0.75x1.2 smd: 1(-1.905,-2.9) 2(-0.635,-2.9) 3(0.635,-2.9) 4(1.905,-2.9) 5(1.905,2.9) 6(0.635,2.9) 7(-0.635,2.9) 8(-1.905,2.9)
  rect 4.5x4.1 smd: 8(0,0.609)
R0603
  rect 0.806x0.864 smd: 1(-0.753,0) 2(0.753,0)
SMB_L4.6-W3.6-LS5.3-BI
  rect 2.047x2.241 smd: 1(-2.591,0) 2(2.591,0)
SOD-323_L1.8-W1.3-LS2.5-RD
  rect 1x0.75 smd: 1(-1.173,0) 2(1.173,0)
SOIC-8_L4.9-W3.9-P1.27-LS6.0-BL
  oval 0.588x2.045 smd: 1(-1.905,-2.772) 2(-0.635,-2.772) 3(0.635,-2.772) 4(1.905,-2.772) 5(1.905,2.772) 6(0.635,2.772) 7(-0.635,2.772) 8(-1.905,2.772)
Test-Point-0.5mm
  round 0.5 smd: 1(0,0)

## Nets
As in the schematic.

## Via types
v1: diameter 0.61, hole 0.305, Top Layer to Bottom Layer, 6 vias

## Routing (per net, layer and track width the routed paths; a pad name or vN(x,y) marks a point on that pad's centre or on a via; arc(x,y) is an arc through that point)
VCC: length 2.1
  Top Layer w0.508: HSFET.8 8.65,16.05 C1.1
NET4: length 7.1
  Top Layer w0.508: 17.53,4.69 16.01,6.2 R6.2 ; 17.53,4.69 17.53,4.69 R5.1 ; 17.53,4.69 18.1,4.11 C5.1
PHASE_OUT: length 35.4
  Top Layer w0.508: LSFET.8 8.7,7.6 7.6,8.7 ; R5.2 19.3,6.67 D2.2 10.14,8.7 ; LSFET.6 11.24,7.6 10.14,8.7 ; 10.14,8.7 8.89,8.7 ; 10.14,8.7 11.24,9.8 HSFET.3 ; 8.89,8.7 9.97,7.62 LSFET.7 ; 8.89,8.7 7.6,8.7 ; 8.89,8.7 9.97,9.78 HSFET.2 ; v1(4.95,9.38) FET_DRV.6 6.34,9.38 7.02,8.7 7.6,8.7 ; 7.6,8.7 8.7,9.8 HSFET.1
  Bottom Layer w0.508: v1(4.95,9.38) 4.23,9.38 3.3,10.32 3.3,13.51 v1(4.51,14.72)
VPA_RSP: length 5.1
  Top Layer w0.508: LSFET.3 LSFET.2 LSFET.1 8.29,1.64 Rsense.2
$1N508: length 9.3
  Top Layer w0.254: R1.1 14.22,12.18 v1(14.1,12.18)
  Bottom Layer w0.508: v1(14.1,12.18) 7.87,12.18 6.35,10.66 v1(5.59,10.66)
$1N509: length 1.9
  Top Layer w0.508: R1.2 13.87,10.31 HSFET.4
$1N510: length 3
  Top Layer w0.508: FET_DRV.5 6.73,6.44 R2.1
$1N511: length 7.1
  Top Layer w0.508: v1(12.45,1.26) 12.49,1.26 LSFET.4
  Bottom Layer w0.508: v1(6.73,4.31) 9.39,4.31 v1(12.45,1.26)
$1N519: length 3.2
  Top Layer w0.508: FET_DRV.1 -0.49,13.05 -1.17,13.73 D1.2
$1N521: length 5.6
  Top Layer w0.508: D1.1 2.98,14.85 C3.1 3.11,14.01 5.06,12.07 FET_DRV.8
